# Altium schematic sheet CircularLED.SchDoc
size A
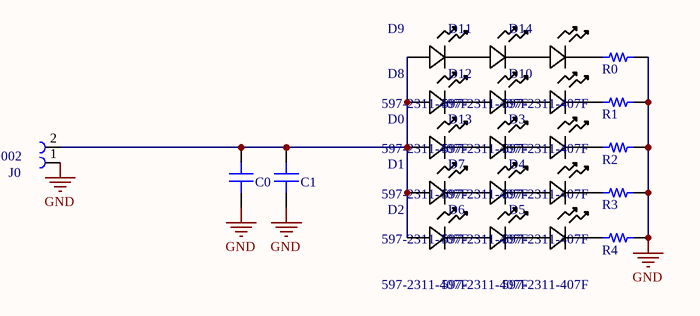
[diagram p0: CircularLED.SchDoc]

## Parts
C0  4.7uF  [CAP 0402/1005]  (value not drawn)
C1  0.1uF  [CAP 0402/1005]  (value not drawn)
D0  597-2311-407F  [LED_597-2311-407F]
D1  597-2311-407F  [LED_597-2311-407F]
D2  597-2311-407F  [LED_597-2311-407F]
D3  597-2311-407F  [LED_597-2311-407F]
D4  597-2311-407F  [LED_597-2311-407F]
D5  597-2311-407F  [LED_597-2311-407F]
D6  597-2311-407F  [LED_597-2311-407F]
D7  597-2311-407F  [LED_597-2311-407F]
D8  597-2311-407F  [LED_597-2311-407F]
D9  597-2311-407F  [LED_597-2311-407F]
D10  597-2311-407F  [LED_597-2311-407F]
D11  597-2311-407F  [LED_597-2311-407F]
D12  597-2311-407F  [LED_597-2311-407F]
D13  597-2311-407F  [LED_597-2311-407F]
D14  597-2311-407F  [LED_597-2311-407F]
J0  691102710002  [691102710002]
R0  200  [RES 0402/1005]  (value not drawn)
R1  200  [RES 0402/1005]  (value not drawn)
R2  200  [RES 0402/1005]  (value not drawn)
R3  200  [RES 0402/1005]  (value not drawn)
R4  200  [RES 0402/1005]  (value not drawn)

## Nets
GND: C0.1 C1.1 J0.1 R0.2 R1.2 R2.2 R3.2 R4.2
NetC0_2: C0.2 C1.2 D0.2 D1.2 D2.2 D8.2 D9.2 J0.2
NetD0_1: D0.1 D13.2
NetD1_1: D1.1 D7.2
NetD2_1: D2.1 D6.2
NetD3_1: D3.1 R2.1
NetD3_2: D3.2 D13.1
NetD4_1: D4.1 R3.1
NetD4_2: D4.2 D7.1
NetD5_1: D5.1 R4.1
NetD5_2: D5.2 D6.1
NetD8_1: D8.1 D12.2
NetD9_1: D9.1 D11.2
NetD10_1: D10.1 R1.1
NetD10_2: D10.2 D12.1
NetD11_1: D11.1 D14.2
NetD14_1: D14.1 R0.1

## Library data of the parts
C0 = C1005X5R1A475K050BC: CAP CER 4.7UF 10V X5R 0402; Manufacturer: TDK Corporation; TemperatureRange: -55C ~ 85C; Tolerance: 10%; Value: 4.7uF; Part Number: C1005X5R1A475K050BC; PartId: 12382; Supplier 1: Digi-Key; Supplier Part Number 1: 445-13820-2-ND; ComponentLink1Description: Datasheet; ComponentLink1URL: https://product.tdk.com/info/en/catalog/datasheets/mlcc_commercial_general_en.pdf; ComponentLink2Description: Digi-Key Listing; ComponentLink2URL: https://www.digikey.com/product-detail/en/tdk-corporation/C1005X5R1A475K050BC/445-13820-2-ND/3951056; TemperatureCoefficient: X5R; Voltage: 10V; Price: 0.096; Device Package: 0402 (1005 Metric)
C1 = C1005X7R1C104K050BC: CAP CER 0.1UF 16V X7R 0402; Manufacturer: TDK Corporation; TemperatureRange: -55C ~ 125C; Tolerance: 10%; Value: 0.1uF; Part Number: C1005X7R1C104K050BC; PartId: 3856; Supplier 1: Digi-Key; Supplier Part Number 1: 445-4952-2-ND; ComponentLink1Description: Datasheet; ComponentLink1URL: https://product.tdk.com/info/en/catalog/datasheets/mlcc_commercial_general_en.pdf; ComponentLink2Description: Digi-Key listing; ComponentLink2URL: http://digikey.com/product-detail/en/C1005X7R1C104K050BC/445-4952-2-ND/2093220; TemperatureCoefficient: X7R; Voltage: 16V; Price: 0.0066; Type: -; Device Package: 0402 (1005 Metric)
D0-D14 = 597-2311-407F: / 597 Series Green 2 mm 130Â° Water Clear 5.2 mcd 2.1 V LED Surface Mount /; MF: Dialight; Availability: Unavailable; Package: None; SnapEDA_Link: https://www.snapeda.com/parts/597-2311-407F/Dialight/view-part/?ref=snap; MP: 597-2311-407F; Price: None; Value: *
J0 = 691102710002: / Screw terminal 0.33 mmÂ² Number of pins 2 Wuerth Elektronik Blue 1 pc_s_ /; MF: Wurth Electronics; Availability: Unavailable; Package: None; SnapEDA_Link: https://www.snapeda.com/parts/691102710002/Wurth%20Electronics%20Inc./view-part/?ref=snap; MP: 691102710002; Price: None; Value: *
R0-R4 = ERJ-2RKF2000X: RES SMD 200 OHM 1% 1/10W 0402; Manufacturer: Panasonic Electronic Components; TemperatureRange: -55C ~ 155C; TemperatureCoefficient: 100ppm/C; PowerRating: 0.1W, 1/10W; Value: 200; Part Number: ERJ-2RKF2000X; PartId: 12; Supplier 1: Digi-Key; Supplier Part Number 1: P200LTR-ND; ComponentLink1Description: Datasheet; ComponentLink1URL: http://industrial.panasonic.com/www-cgi/jvcr13pz.cgi?E+PZ+3+AOA0002+ERJ2RKF2000X+7+WW; ComponentLink2Description: Digikey listing; ComponentLink2URL: http://digikey.com/product-detail/en/ERJ-2RKF2000X/P200LTR-ND/192215; Tolerance: 1%; Price: 0.0043; Type: Thick Film; Device Package: 0402 (1005 Metric)